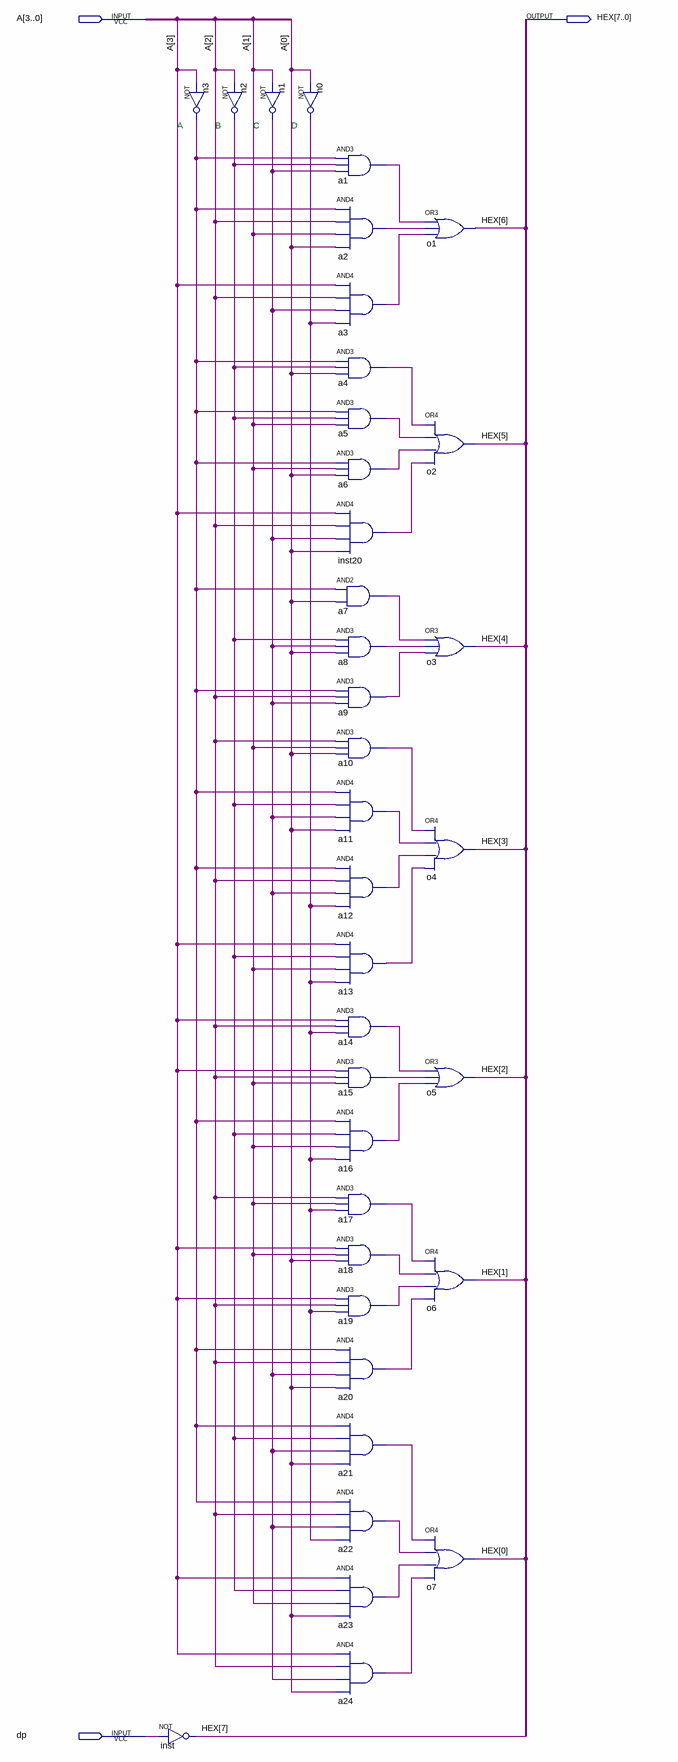
[diagram p0: schematic sheet]
// Quartus schematic hex.bdf as structural Verilog: 37 symbols, 3 pins
module hex (
  input  [3:0] A,
  input  dp,
  output [7:0] HEX
);

  wire a1_out, a2_out, a3_out, a4_out, a5_out, a6_out, a7_out, a8_out, a9_out, a10_out, a11_out, a12_out,
       a13_out, a14_out, a15_out, a16_out, a17_out, a18_out, a19_out, a20_out, a21_out, a22_out, a23_out,
       a24_out, inst20_out, n0_out, n1_out, n2_out, n3_out;

  not n3 (n3_out, A[3]);
  not inst (HEX[7], dp);
  not n2 (n2_out, A[2]);
  not n1 (n1_out, A[1]);
  not n0 (n0_out, A[0]);
  and a1 (a1_out, n3_out, n2_out, n1_out);
  and a2 (a2_out, n3_out, A[2], A[1], A[0]);
  and a3 (a3_out, A[3], A[2], n1_out, n0_out);
  and a4 (a4_out, n3_out, n2_out, A[0]);
  and a5 (a5_out, n3_out, n2_out, A[1]);
  and a6 (a6_out, n3_out, A[1], A[0]);
  and inst20 (inst20_out, A[3], A[2], n1_out, A[0]);
  and a7 (a7_out, n3_out, A[0]);
  and a8 (a8_out, n2_out, n1_out, A[0]);
  and a9 (a9_out, n3_out, A[2], n1_out);
  and a10 (a10_out, A[2], A[1], A[0]);
  and a11 (a11_out, n3_out, n2_out, n1_out, A[0]);
  and a12 (a12_out, n3_out, A[2], n1_out, n0_out);
  and a13 (a13_out, A[3], n2_out, A[1], n0_out);
  and a14 (a14_out, A[3], A[2], n0_out);
  and a15 (a15_out, A[3], A[2], A[1]);
  and a16 (a16_out, n3_out, n2_out, A[1], n0_out);
  and a17 (a17_out, A[2], A[1], n0_out);
  and a18 (a18_out, A[3], A[1], A[0]);
  and a19 (a19_out, A[3], A[2], n0_out);
  and a20 (a20_out, n3_out, A[2], n1_out, A[0]);
  and a21 (a21_out, n3_out, n2_out, n1_out, A[0]);
  and a22 (a22_out, n3_out, A[2], n1_out, n0_out);
  and a23 (a23_out, A[3], n2_out, A[1], A[0]);
  and a24 (a24_out, A[3], A[2], n1_out, A[0]);
  or o1 (HEX[6], a1_out, a2_out, a3_out);
  or o2 (HEX[5], a4_out, a5_out, a6_out, inst20_out);
  or o3 (HEX[4], a7_out, a8_out, a9_out);
  or o4 (HEX[3], a10_out, a11_out, a12_out, a13_out);
  or o5 (HEX[2], a14_out, a15_out, a16_out);
  or o6 (HEX[1], a17_out, a18_out, a19_out, a20_out);
  or o7 (HEX[0], a21_out, a22_out, a23_out, a24_out);

  // Notes on the sheet:
  //   A
  //   B
  //   C
  //   D
endmodule
